# Altium schematic sheet TOP.SchDoc
size A4; DrawnBy: YuJian; SheetNumber: 1; SheetTotal: 6
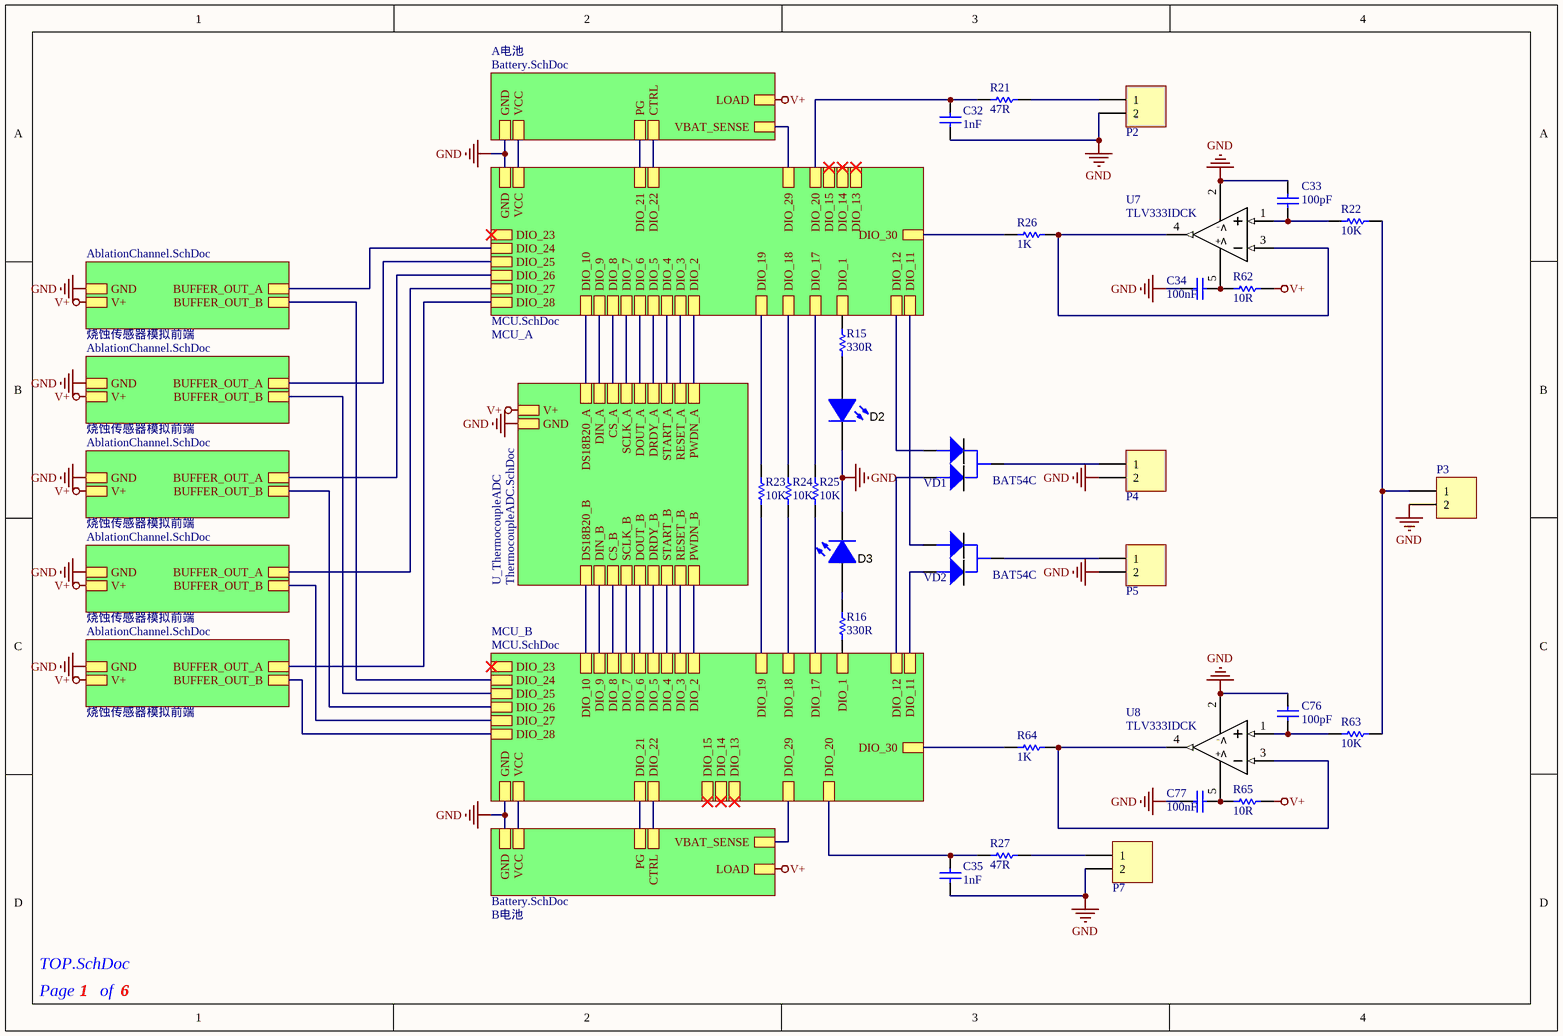
[diagram p0: TOP.SchDoc]

## Parts
C32  1nF  [R0603_C]
C33  100pF  [R0603_C]
C34  100nF  [R0603_C]
C35  1nF  [R0603_C]
C76  100pF  [R0603_C]
C77  100nF  [R0603_C]
D2  MHT192WDT-C2  [LED_0603_RED]  (value not drawn)
D3  MHT192WDT-C2  [LED_0603_RED]  (value not drawn)
P2  Header 2  [CP1X2]  (value not drawn)
P3  Header 2  [CP1X2]  (value not drawn)
P4  Header 2  [CP1X2]  (value not drawn)
P5  Header 2  [CP1X2]  (value not drawn)
P7  Header 2  [CP1X2]  (value not drawn)
R15  330R  [R0603_R]
R16  330R  [R0603_R]
R21  47R  [R0603_R]
R22  10K  [R0603_R]
R23  10K  [R0603_R]
R24  10K  [R0603_R]
R25  10K  [R0603_R]
R26  1K  [R0603_R]
R27  47R  [R0603_R]
R62  10R  [R0603_R]
R63  10K  [R0603_R]
R64  1K  [R0603_R]
R65  10R  [R0603_R]
U7  TLV333IDCK  [DCK0005A_N]
U8  TLV333IDCK  [DCK0005A_N]
VD1  BAT54C  [SOT-23(SOT-23-3)]
VD2  BAT54C  [SOT-23(SOT-23-3)]

## Sub-sheets
U_AblationChannel = AblationChannel.SchDoc: BUFFER_OUT_A, GND, BUFFER_OUT_B, V+  | Parameter 2: 烧蚀传感器模拟前端
U_AblationChannel = AblationChannel.SchDoc: BUFFER_OUT_A, GND, BUFFER_OUT_B, V+  | Parameter 2: 烧蚀传感器模拟前端
U_AblationChannel = AblationChannel.SchDoc: BUFFER_OUT_A, GND, BUFFER_OUT_B, V+  | Parameter 2: 烧蚀传感器模拟前端
U_AblationChannel = AblationChannel.SchDoc: BUFFER_OUT_A, GND, BUFFER_OUT_B, V+  | Parameter 2: 烧蚀传感器模拟前端
U_AblationChannel = AblationChannel.SchDoc: BUFFER_OUT_A, GND, BUFFER_OUT_B, V+  | Parameter 2: 烧蚀传感器模拟前端
U_Battery = Battery.SchDoc: LOAD, CTRL, PG, VCC, GND, VBAT_SENSE  | Parameter 2: B电池
U_Battery = Battery.SchDoc: LOAD, CTRL, PG, VCC, GND, VBAT_SENSE  | Parameter 2: A电池
U_MCU = MCU.SchDoc: DIO_2, DIO_3, DIO_4, DIO_5, DIO_6, DIO_1, DIO_8, DIO_9, DIO_10, DIO_11, DIO_12, DIO_13, DIO_14, DIO_15, DIO_17, DIO_18, DIO_19, DIO_20, DIO_21, DIO_22, DIO_23, DIO_24, DIO_25, DIO_26, DIO_27, DIO_28, DIO_29, DIO_30, GND, VCC, DIO_7  | Parameter 2: MCU_B
U_MCU = MCU.SchDoc: DIO_2, DIO_3, DIO_4, DIO_5, DIO_6, DIO_1, DIO_8, DIO_9, DIO_10, DIO_11, DIO_12, DIO_13, DIO_14, DIO_15, DIO_17, DIO_18, DIO_19, DIO_20, DIO_21, DIO_22, DIO_23, DIO_24, DIO_25, DIO_26, DIO_27, DIO_28, DIO_29, DIO_30, GND, VCC, DIO_7  | Parameter 2: MCU_A
U_ThermocoupleADC = ThermocoupleADC.SchDoc: GND, V+, DS18B20_A, DRDY_A, SCLK_A, CS_A, DIN_A, DOUT_A, PWDN_A, START_A, RESET_A, DS18B20_B, DRDY_B, SCLK_B, CS_B, DIN_B, DOUT_B, PWDN_B, START_B, RESET_B

## Nets
GND: C32.1 C33.1 C34.1 C35.1 C76.1 C77.1 D2.2(K) D3.2(K) P2.2 P3.2 P4.2 P5.2 P7.2 U7.2(V-) U8.2(V-) ; sheet U_Battery/GND, sheet U_MCU/GND, sheet U_AblationChannel/GND, sheet U_MCU/GND, sheet U_AblationChannel/GND, sheet U_AblationChannel/GND, sheet U_AblationChannel/GND, sheet U_AblationChannel/GND, sheet U_Battery/GND, sheet U_ThermocoupleADC/GND
V+: R62.2 R65.2 ; sheet U_Battery/LOAD, sheet U_AblationChannel/V+, sheet U_AblationChannel/V+, sheet U_AblationChannel/V+, sheet U_AblationChannel/V+, sheet U_AblationChannel/V+, sheet U_Battery/LOAD, sheet U_ThermocoupleADC/V+
NetC32_2: C32.2 R21.1 ; sheet U_MCU/DIO_20
NetC33_2: C33.2 R22.2 U7.1(IN+)
NetC34_2: C34.2 R62.1 U7.5(V+)
NetC35_2: C35.2 R27.1 ; sheet U_MCU/DIO_20
NetC76_2: C76.2 R63.2 U8.1(IN+)
NetC77_2: C77.2 R65.1 U8.5(V+)
NetD2_1: D2.1(A) R15.1
NetD3_1: D3.1(A) R16.2
NetP2_1: P2.1 R21.2
NetP3_1: P3.1 R22.1 R63.1
NetP4_1: P4.1 VD1.3(K)
NetP5_1: P5.1 VD2.3(K)
NetP7_1: P7.1 R27.2
NetR15_2: R15.2 ; sheet U_MCU/DIO_1
NetR16_1: R16.1 ; sheet U_MCU/DIO_1
NetR23_1: R23.1 ; sheet U_MCU/DIO_19
NetR23_2: R23.2 ; sheet U_MCU/DIO_19
NetR24_1: R24.1 ; sheet U_MCU/DIO_18
NetR24_2: R24.2 ; sheet U_MCU/DIO_18
NetR25_1: R25.1 ; sheet U_MCU/DIO_17
NetR25_2: R25.2 ; sheet U_MCU/DIO_17
NetR26_1: R26.1 U7.3(IN-) U7.4(OUT)
NetR26_2: R26.2 ; sheet U_MCU/DIO_30
NetR64_1: R64.1 U8.3(IN-) U8.4(OUT)
NetR64_2: R64.2 ; sheet U_MCU/DIO_30
NetVD1_1: VD1.1(A1) ; sheet U_MCU/DIO_12
NetVD1_2: VD1.2(A2) ; sheet U_MCU/DIO_12
NetVD2_1: VD2.1(A1) ; sheet U_MCU/DIO_11
NetVD2_2: VD2.2(A2) ; sheet U_MCU/DIO_11
(unnamed): sheet U_Battery/CTRL, sheet U_MCU/DIO_22
(unnamed): sheet U_Battery/PG, sheet U_MCU/DIO_21
(unnamed): sheet U_Battery/VCC, sheet U_MCU/VCC
(unnamed): sheet U_Battery/VBAT_SENSE, sheet U_MCU/DIO_29
(unnamed): sheet U_MCU/DIO_2, sheet U_ThermocoupleADC/PWDN_B
(unnamed): sheet U_MCU/DIO_3, sheet U_ThermocoupleADC/RESET_B
(unnamed): sheet U_MCU/DIO_4, sheet U_ThermocoupleADC/START_B
(unnamed): sheet U_MCU/DIO_5, sheet U_ThermocoupleADC/DRDY_B
(unnamed): sheet U_MCU/DIO_6, sheet U_ThermocoupleADC/DOUT_B
(unnamed): sheet U_MCU/DIO_8, sheet U_ThermocoupleADC/CS_B
(unnamed): sheet U_MCU/DIO_9, sheet U_ThermocoupleADC/DIN_B
(unnamed): sheet U_MCU/DIO_10, sheet U_ThermocoupleADC/DS18B20_B
(unnamed): sheet U_MCU/DIO_24, sheet U_AblationChannel/BUFFER_OUT_B
(unnamed): sheet U_MCU/DIO_25, sheet U_AblationChannel/BUFFER_OUT_B
(unnamed): sheet U_MCU/DIO_26, sheet U_AblationChannel/BUFFER_OUT_B
(unnamed): sheet U_MCU/DIO_27, sheet U_AblationChannel/BUFFER_OUT_B
(unnamed): sheet U_MCU/DIO_28, sheet U_AblationChannel/BUFFER_OUT_B
(unnamed): sheet U_MCU/DIO_7, sheet U_ThermocoupleADC/SCLK_B
(unnamed): sheet U_AblationChannel/BUFFER_OUT_A, sheet U_MCU/DIO_24
(unnamed): sheet U_MCU/DIO_2, sheet U_ThermocoupleADC/PWDN_A
(unnamed): sheet U_MCU/DIO_3, sheet U_ThermocoupleADC/RESET_A
(unnamed): sheet U_MCU/DIO_4, sheet U_ThermocoupleADC/START_A
(unnamed): sheet U_MCU/DIO_5, sheet U_ThermocoupleADC/DRDY_A
(unnamed): sheet U_MCU/DIO_6, sheet U_ThermocoupleADC/DOUT_A
(unnamed): sheet U_MCU/DIO_8, sheet U_ThermocoupleADC/CS_A
(unnamed): sheet U_MCU/DIO_9, sheet U_ThermocoupleADC/DIN_A
(unnamed): sheet U_MCU/DIO_10, sheet U_ThermocoupleADC/DS18B20_A
(unnamed): sheet U_MCU/DIO_21, sheet U_Battery/PG
(unnamed): sheet U_MCU/DIO_22, sheet U_Battery/CTRL
(unnamed): sheet U_MCU/DIO_25, sheet U_AblationChannel/BUFFER_OUT_A
(unnamed): sheet U_MCU/DIO_26, sheet U_AblationChannel/BUFFER_OUT_A
(unnamed): sheet U_MCU/DIO_27, sheet U_AblationChannel/BUFFER_OUT_A
(unnamed): sheet U_MCU/DIO_28, sheet U_AblationChannel/BUFFER_OUT_A
(unnamed): sheet U_MCU/DIO_29, sheet U_Battery/VBAT_SENSE
(unnamed): sheet U_MCU/VCC, sheet U_Battery/VCC
(unnamed): sheet U_MCU/DIO_7, sheet U_ThermocoupleADC/SCLK_A

## Notes on the sheet
- Page
- of

## Library data of the parts
C32 C35 = 1nF/0603/50V: 精度 ±5% / 容值 1nF / 额定电压 50V / 温漂系数（介质材料) C0G; 厂家: FH(风华); 型号: 0603CG102J500NT; 封装: 0603; 类型: Capacitor; 订货编码: C1636
C33 C76 = 100pF/0603/50V: 精度 ±5% / 容值 100pF / 额定电压 50V / 温漂系数（介质材料) C0G; 厂家: FH(风华); 型号: 0603CG101J500NT; 封装: 0603; 类型: Capacitor; 订货编码: C1635
C34 C77 = 100nF/0603/50V: 精度 ±10% / 容值 100nF / 额定电压 50V / 温漂系数（介质材料) X7R; 厂家: FH(风华); 型号: 0603B104K500NT; 封装: 0603; 类型: Capacitor; 订货编码: C30926
D2 D3 = MHT192WDT-C2: LED SMD贴片0603顶部发光 / 黄色雾状胶体，高亮白色光 / 电压VF:2.6-3.1V@5mA / 亮度Iv:228-450mcd@5mA / 坐标x:0.3,y:0.3 / 发光角度:120deg; 厂家: MEIHUA(美华科技); 封装: 0603; 订货编码: C389521; 型号: MHT192WDT-C2; 类型: LED
P2-P5 P7 = Header 2: Header, 2-Pin; 厂家: /; System: Connector; 型号: /; 封装: /; 类型: /; 订货编码: /
R15 R16 = 330R/0603: 精度 ±1% / 温度系数 ±100ppm/℃ / 阻值 330Ω / 功率 0.1W; 厂家: FH(风华); 型号: RS-03K3300FT; 类型: Resistor; 订货编码: C125768; 封装: 0603
R21 R27 = 47R/0603: 精度 ±1% / 温度系数 ±100ppm/℃ / 阻值 47Ω / 功率 0.1W; 厂家: FH(风华); 型号: RS-03K47R0FT; 类型: Resistor; 订货编码: C140087; 封装: 0603
R22-R25 R63 = 10K/0603: 精度 ±1% / 温度系数 ±100ppm/℃ / 阻值 10kΩ / 功率 0.1W; 厂家: FH(风华); 型号: RS-03K1002FT; 类型: Resistor; 订货编码: C115324; 封装: 0603
R26 R64 = 1K/0603: 精度 ±1% / 温度系数 ±100ppm/℃ / 阻值 1kΩ / 功率 0.1W; 厂家: FH(风华); 型号: RS-03K1001FT; 类型: Resistor; 订货编码: C115325; 封装: 0603
R62 R65 = 10R/0603: 精度 ±1% / 阻值 10Ω / 温度系数 ±100ppm/℃ / 功率 0.1W; 厂家: FH(风华); 型号: RS-03K10R0FT; 类型: Resistor; 订货编码: C136596; 封装: 0603
U7 U8 = TLV333IDCK: 电源电压 1.8V ~ 5.5V, ±0.9V ~ 2.75V / 增益带宽积（GBP） 350kHz / 压摆率（SR） 0.16 V/us / 工作温度 -40°C ~ 125°C /; 厂家: TI(德州仪器); 封装: SC-70-5; 类型: 运放; 订货编码: C181502; 型号: TLV333IDCK
VD1 VD2 = BAT54C: 共阴极，IF=0.2A,VRRM=30V,VF=0.24V@0.1mA,IR=2uA@25V,trr=5ns,SOT23-3,-55℃～150℃; 厂家: Nexperia(安世); 型号: BAT54C,215; 封装: SOT-23-3; 类型: 肖特基二极管; 订货编码: C37704